# Altium schematic sheet loop_2_SMA.SchDoc
size A4
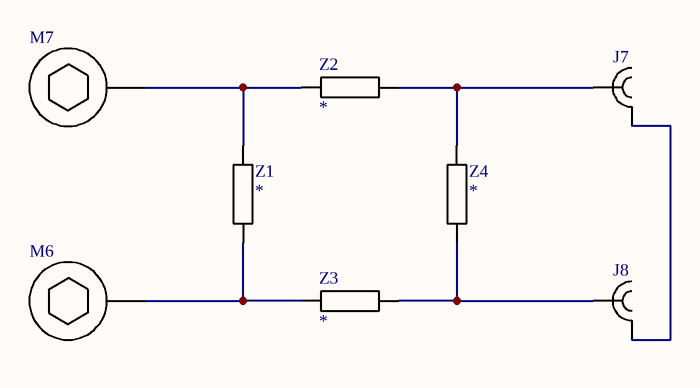
[diagram p0: loop_2_SMA.SchDoc]

## Parts
J7  CONSMA001-G  [SMA TH Vertical Linx CONSMA001-G]  (value not drawn)
J8  CONSMA001-G  [SMA TH Vertical Linx CONSMA001-G]  (value not drawn)
M6  (no value)  [Screw Hex Socket M2.5X4 Connected]
M7  (no value)  [Screw Hex Socket M2.5X4 Connected]
Z1  *  [RESISTOR 2012 REFLOW]
Z2  *  [RESISTOR 2012 REFLOW]
Z3  *  [RESISTOR 2012 REFLOW]
Z4  *  [RESISTOR 2012 REFLOW]

## Nets
NetJ7_1: J7.1 Z2.2 Z4.2
NetJ7_2: J7.2 J8.2
NetJ8_1: J8.1 Z3.2 Z4.1
NetM6_1: M6.1 Z1.1 Z3.1
NetM7_1: M7.1 Z1.2 Z2.1

## Library data of the parts
J7 J8 = SMA TH VERTICAL LINX CONSMA001-G: Value: CONSMA001-G
M6 M7 = Screw Hex Socket Connected: Screw Hex Socket Connected BN610
Z1-Z4 = Resistor: Value: *